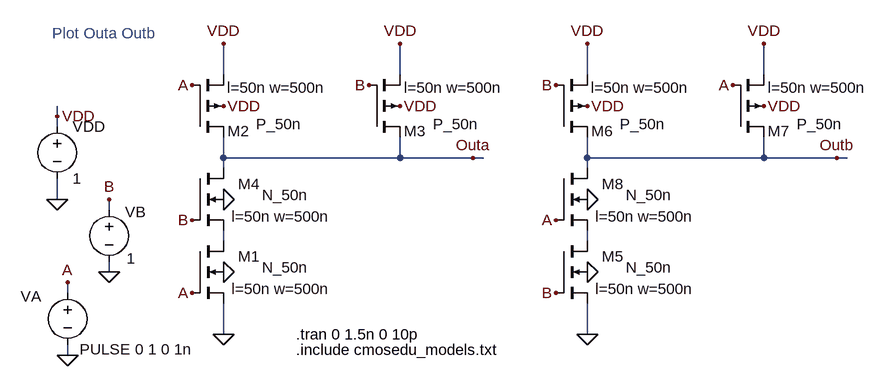
[diagram p0: schematic Fig18_15.asc]
Fig18_15.asc, the LTspice schematic file:
Version 4
SHEET 1 1440 680
WIRE 448 -432 448 -480
WIRE 720 -432 720 -480
WIRE 1008 -432 1008 -480
WIRE 1280 -432 1280 -480
WIRE 192 -368 192 -384
WIRE 192 -352 192 -368
WIRE 448 -304 448 -336
WIRE 720 -304 720 -336
WIRE 720 -304 448 -304
WIRE 832 -304 720 -304
WIRE 848 -304 832 -304
WIRE 1008 -304 1008 -336
WIRE 1280 -304 1280 -336
WIRE 1280 -304 1008 -304
WIRE 1392 -304 1280 -304
WIRE 1408 -304 1392 -304
WIRE 448 -288 448 -304
WIRE 1008 -288 1008 -304
WIRE 192 -240 192 -272
WIRE 272 -224 272 -240
WIRE 448 -176 448 -192
WIRE 1008 -176 1008 -192
WIRE 272 -128 272 -144
WIRE 208 -96 208 -112
WIRE 448 -32 448 -80
WIRE 1008 -32 1008 -80
WIRE 208 0 208 -16
FLAG 208 0 0
FLAG 208 -112 A
FLAG 448 -128 0
FLAG 192 -240 0
FLAG 192 -368 VDD
FLAG 448 -384 VDD
FLAG 448 -32 0
FLAG 448 -480 VDD
FLAG 720 -384 VDD
FLAG 448 -240 0
FLAG 720 -480 VDD
FLAG 832 -304 Outa
FLAG 1008 -128 0
FLAG 1008 -384 VDD
FLAG 1008 -32 0
FLAG 1008 -480 VDD
FLAG 1280 -384 VDD
FLAG 1008 -240 0
FLAG 1280 -480 VDD
FLAG 1392 -304 Outb
FLAG 400 -96 A
FLAG 672 -416 B
FLAG 960 -208 A
FLAG 960 -416 B
FLAG 400 -416 A
FLAG 400 -208 B
FLAG 960 -96 B
FLAG 1232 -416 A
FLAG 272 -128 0
FLAG 272 -240 B
SYMBOL nmos4 400 -176 R0
WINDOW 0 104 24 Right 2
WINDOW 3 179 41 Right 2
WINDOW 123 213 74 Right 2
SYMATTR InstName M1
SYMATTR Value N_50n
SYMATTR Value2 l=50n w=500n
SYMBOL voltage 208 -112 R0
WINDOW 0 -72 21 Left 2
WINDOW 3 19 103 Left 2
WINDOW 123 0 0 Left 2
WINDOW 39 0 0 Left 2
SYMATTR InstName VA
SYMATTR Value PULSE 0 1 0 1n
SYMBOL voltage 192 -368 R0
WINDOW 123 0 0 Left 2
WINDOW 39 0 0 Left 2
SYMATTR InstName VDD
SYMATTR Value 1
SYMBOL pmos4 400 -336 M180
WINDOW 0 88 9 Right 2
WINDOW 3 168 20 Right 2
WINDOW 123 206 76 Right 2
SYMATTR InstName M2
SYMATTR Value P_50n
SYMATTR Value2 l=50n w=500n
SYMBOL pmos4 672 -336 M180
WINDOW 0 88 9 Right 2
WINDOW 3 168 20 Right 2
WINDOW 123 206 76 Right 2
SYMATTR InstName M3
SYMATTR Value P_50n
SYMATTR Value2 l=50n w=500n
SYMBOL nmos4 400 -288 R0
WINDOW 0 104 24 Right 2
WINDOW 3 179 41 Right 2
WINDOW 123 213 74 Right 2
SYMATTR InstName M4
SYMATTR Value N_50n
SYMATTR Value2 l=50n w=500n
SYMBOL nmos4 960 -176 R0
WINDOW 0 104 24 Right 2
WINDOW 3 179 41 Right 2
WINDOW 123 213 74 Right 2
SYMATTR InstName M5
SYMATTR Value N_50n
SYMATTR Value2 l=50n w=500n
SYMBOL pmos4 960 -336 M180
WINDOW 0 88 9 Right 2
WINDOW 3 168 20 Right 2
WINDOW 123 206 76 Right 2
SYMATTR InstName M6
SYMATTR Value P_50n
SYMATTR Value2 l=50n w=500n
SYMBOL pmos4 1232 -336 M180
WINDOW 0 88 9 Right 2
WINDOW 3 168 20 Right 2
WINDOW 123 206 76 Right 2
SYMATTR InstName M7
SYMATTR Value P_50n
SYMATTR Value2 l=50n w=500n
SYMBOL nmos4 960 -288 R0
WINDOW 0 104 24 Right 2
WINDOW 3 179 41 Right 2
WINDOW 123 213 74 Right 2
SYMATTR InstName M8
SYMATTR Value N_50n
SYMATTR Value2 l=50n w=500n
SYMBOL voltage 272 -240 R0
WINDOW 0 25 19 Left 2
WINDOW 3 27 91 Left 2
WINDOW 123 0 0 Left 2
WINDOW 39 0 0 Left 2
SYMATTR InstName VB
SYMATTR Value 1
TEXT 560 -32 Left 2 !.tran 0 1.5n 0 10p
TEXT 560 -8 Left 2 !.include cmosedu_models.txt
TEXT 184 -496 Left 2 ;Plot Outa Outb

The netlist it stands for:
* Fig18_15.asc
M1 N001 A 0 0 N_50n l=50n w=500n
VA A 0 PULSE 0 1 0 1n
VDD VDD 0 1
M2 Outa A VDD VDD P_50n l=50n w=500n
M3 Outa B VDD VDD P_50n l=50n w=500n
M4 Outa B N001 0 N_50n l=50n w=500n
M5 N002 B 0 0 N_50n l=50n w=500n
M6 Outb B VDD VDD P_50n l=50n w=500n
M7 Outb A VDD VDD P_50n l=50n w=500n
M8 Outb A N002 0 N_50n l=50n w=500n
VB B 0 1
.model NMOS NMOS
.model PMOS PMOS
.lib standard.mos
.tran 0 1.5n 0 10p
.include cmosedu_models.txt
* Plot Outa Outb
.backanno
.end